# EAGLE design brunnen_v2 (EAGLE 9.5.2)
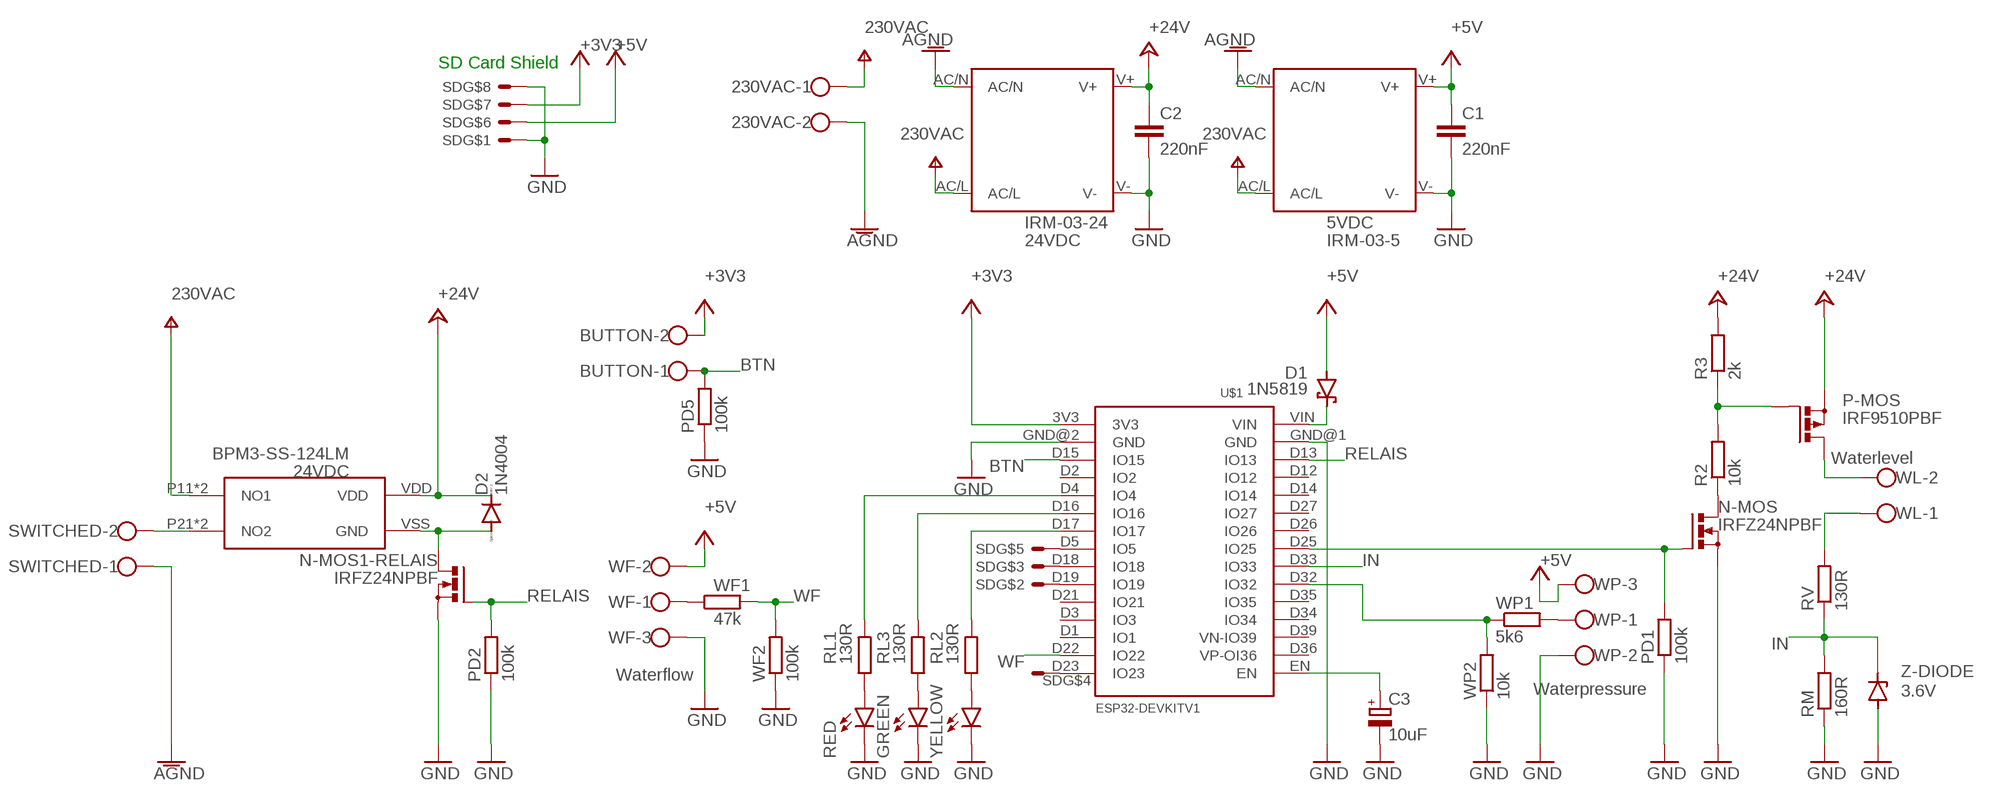
[diagram p0: schematic, sheet 1]

## Parts
230VAC  W237-102  [W237-102]
BUTTON  W237-102  [W237-102]
C1  220nF  C-EU025-025X050  [C025-025X050]
C2  220nF  C-EU025-025X050  [C025-025X050]
C3  10uF  CPOL-EUE2-4  [E2-4]
D1  1N5819  1N5819-B  [DO41-7.6]
D2  1N4004  [DO41-10]
GREEN  LED5MM  [LED5MM]
IRM-03-5  5VDC  IRM_03IRM_03  [IRM_03]
IRM-03-24  24VDC  IRM_03IRM_03  [IRM_03]
N-MOS  IRFZ24NPBF  PMOSFET_NTO220BV  [TO220BV]
N-MOS1-RELAIS  IRFZ24NPBF  PMOSFET_NTO220BV  [TO220BV]
P-MOS  IRF9510PBF  PMOSFET_PTO220BV  [TO220BV]
PD1  100k  R-EU_0207/10  [0207/10]
PD2  100k  R-EU_0207/10  [0207/10]
PD5  100k  R-EU_0207/10  [0207/10]
R2  10k  R-EU_0207/10  [0207/10]
R3  2k  R-EU_0207/10  [0207/10]
RED  LED5MM  [LED5MM]
RL1  130R  R-EU_0207/10  [0207/10]
RL2  130R  R-EU_0207/10  [0207/10]
RL3  130R  R-EU_0207/10  [0207/10]
RM  160R  R-EU_0207/10  [0207/10]
RV  130R  R-EU_0207/10  [0207/10]
SD  322-16-DUAL  [322-16-DUAL]
SWITCHED  W237-102  [W237-102]
U$1  ESP32DEVKITV1  [ESP32-DEVKITV1]
U$2  BPM3-SS-124LM  [BPM3-SS-124LM]
WF  Waterflow  W237-103  [W237-103]
WF1  47k  R-EU_0207/10  [0207/10]
WF2  100k  R-EU_0207/10  [0207/10]
WL  Waterlevel  W237-102  [W237-102]
WP  Waterpressure  W237-103  [W237-103]
WP1  5k6  R-EU_0207/10  [0207/10]
WP2  10k  R-EU_0207/10  [0207/10]
YELLOW  LED5MM  [LED5MM]
Z-DIODE  3.6V  ZENER-DIODEF126-10  [F126Z10]

## Nets
+3V3: BUTTON.2 SD.13 SD.14 U$1.3V3
+5V: C1.1 D1.A IRM-03-5.V+ SD.11 SD.12 WF.2 WP.3
+24V: C2.1 D2.C IRM-03-24.V+ P-MOS.S R3.2 U$2.VDD
AGND: 230VAC.2 IRM-03-5.AC/N IRM-03-24.AC/N SWITCHED.1
BTN: BUTTON.1 PD5.2 U$1.D15(IO15)
GND: C1.2 C2.2 C3.- GREEN.K(C) IRM-03-5.V- IRM-03-24.V- N-MOS1-RELAIS.S N-MOS.S PD1.1 PD2.1 PD5.1 RED.K(C) RM.1 SD.1 SD.2 SD.15 SD.16 U$1.GND@1(GND) U$1.GND@2(GND) WF2.1 WF.3 WP2.1 WP.2 YELLOW.K(C) Z-DIODE.A
IN: RM.2 RV.1 U$1.D33(IO33) Z-DIODE.C
N$1: N-MOS.G PD1.2 U$1.D25(IO25)
N$2: N-MOS.D R2.1
N$3: P-MOS.G R2.2 R3.1
N$4: P-MOS.D WL.2
N$5: D1.C U$1.VIN
N$6: SWITCHED.2 U$2.P21(NO2) U$2.P22(NO2)
N$7: WF1.1 WF.1
N$8: D2.A N-MOS1-RELAIS.D U$2.VSS(GND)
N$9: WP1.2 WP.1
N$10: U$1.D32(IO32) WP1.1 WP2.2
N$14: RV.2 WL.1
N$16: RED.A RL1.1
N$17: RL2.2 U$1.D17(IO17)
N$18: RL2.1 YELLOW.A
N$19: GREEN.A RL3.1
N$20: RL3.2 U$1.D16(IO16)
N$21: RL1.2 U$1.D4(IO4)
N$22: SD.7 SD.8 U$1.D23(IO23)
N$23: C3.+ U$1.EN
N$24: SD.5 SD.6 U$1.D18(IO18)
N$25: SD.9 SD.10 U$1.D5(IO5)
N$26: SD.3 SD.4 U$1.D19(IO19)
RELAIS: N-MOS1-RELAIS.G PD2.2 U$1.D13(IO13)
V+: 230VAC.1 IRM-03-5.AC/L IRM-03-24.AC/L U$2.P11(NO1) U$2.P12(NO1) ; supply symbol labelled 230VAC
WF: U$1.D22(IO22) WF1.2 WF2.2
Unconnected: U$1.D1(IO1) U$1.D2(IO2) U$1.D3(IO3) U$1.D12(IO12) U$1.D14(IO14) U$1.D21(IO21) U$1.D26(IO26) U$1.D27(IO27) U$1.D34(IO34) U$1.D35(IO35) U$1.D36(VP-OI36) U$1.D39(VN-IO39)

## Notes on the sheet
- SD Card Shield

## Library data of the parts
230VAC BUTTON SWITCHED WL = con-wago-500:W237-102: WAGO SCREW CLAMP; MPN: 237-102; OC_FARNELL: unknown; OC_NEWARK: 70K9898
C1 C2 = rcl:C-EU: CAPACITOR, European symbol; SPICEPREFIX: C
C3 = rcl:CPOL-EU: POLARIZED CAPACITOR, European symbol; SPICEPREFIX: C
D1 = diode:1N581*: 1.0A SCHOTTKY BARRIER RECTIFIER Source: http://www.diodes.com/datasheets/ds23001.pdf
D2 = diode:1N4004: DIODE general purpose rectifier, 1 A
GREEN RED YELLOW = led:LED: LED OSRAM: - CHIPLED LG R971, LG N971, LY N971, LG Q971, LY Q971, LO R971, LY R971 LH N974, LH R974 LS Q976, LO Q976, LY Q976 LO Q996 - Hyper CHIPLED LW Q18S LB Q993, LB Q99A, LB R99A - SideLED LS A670, LO A670, LY A670, LG A670, LP A670 LB A673, LV A673, LT A673, LW A673 LH A674 LY A675 LS A676, LA A676, LO A676, LY A676, LW A676 LS A679, LY A679, LG A679 - Hyper Micro SIDELED® LS Y876, LA Y876, LO Y876, LY Y876 LT Y87S - SmartLED LW L88C, LW L88S LB L89C, LB L89S, LG L890 LS L89K, LO L89K, LY L89K LS L896, LA L896, LO L896, LY L896 - TOPLED LS T670, LO T670, LY T670, LG T670, LP T670 LSG T670, LSP T670, LSY T670, LOP T670, LYG T670 LG T671, LOG T671, LSG T671 LB T673, LV T673, LT T673, LW T673 LH T674 LS T676, LA T676, LO T676, LY T676, LB T676, LH T676, LSB T676, LW T676 LB T67C, LV T67C, LT T67C, LS T67K, LO T67K, LY T67K, LW E67C LS E67B, LA E67B, LO E67B, LY E67B, LB E67C, LV E67C, LT E67C LW T67C LS T679, LY T679, LG T679 LS T770, LO T770, LY T770, LG T770, LP T770 LB T773, LV T773, LT T773, LW T773 LH T774 LS E675, LA E675, LY E675, LS T675 LS T776, LA T776, LO T776, LY T776, LB T776 LHGB T686 LT T68C, LB T68C - Hyper Mini TOPLED® LB M676 - Mini TOPLED Santana® LG M470 LS M47K, LO M47K, LY M47K Source: http://www.osram.convergy.de LUXEON: - LUMILED® LXK2-PW12-R00, LXK2-PW12-S00, LXK2-PW14-U00, LXK2-PW14-V00 LXK2-PM12-R00, LXK2-PM12-S00, LXK2-PM14-U00 LXK2-PE12-Q00, LXK2-PE12-R00, LXK2-PE12-S00, LXK2-PE14-T00, LXK2-PE14-U00 LXK2-PB12-K00, LXK2-PB12-L00, LXK2-PB12-M00, LXK2-PB14-N00, LXK2-PB14-P00, LXK2-PB14-Q00 LXK2-PR12-L00, LXK2-PR12-M00, LXK2-PR14-Q00, LXK2-PR14-R00 LXK2-PD12-Q00, LXK2-PD12-R00, LXK2-PD12-S00 LXK2-PH12-R00, LXK2-PH12-S00 LXK2-PL12-P00, LXK2-PL12-Q00, LXK2-PL12-R00 Source: www.luxeon.com KINGBRIGHT: KA-3528ASYC Source: www.kingbright.com
IRM-03-5 IRM-03-24 = meanwell_irm_v7:IRM_03: 3 watt IRM 03 Vout [V] Imax [A] Pmax [W] Eff [%] 3.3 0.9 3 68 5 0.6 3 72 9 0.33 3 77 12 0.25 3 78 15 0.2 3 78 24 0.125 3 80
N-MOS N-MOS1-RELAIS = transistor-power:PMOSFET_N: Power MOSFET N-Channel
P-MOS = transistor-power:PMOSFET_P: Power MOSFET P-Channel
PD1 PD2 PD5 R2 R3 RL1-RL3 RM RV WF1 WF2 WP1 WP2 = rcl:R-EU_: RESISTOR, European symbol; SPICEPREFIX: R
SD = con-garry:322-16-DUAL
U$1 = ESP32-DEVKITV1:ESP32DEVKITV1
U$2 = Costum Relais:BPM3-SS-124LM
WF WP = con-wago-500:W237-103: WAGO SCREW CLAMP; MPN: 237-103; OC_FARNELL: unknown; OC_NEWARK: 18M7116
Z-DIODE = diode:ZENER-DIODE: Z-Diode

## Board
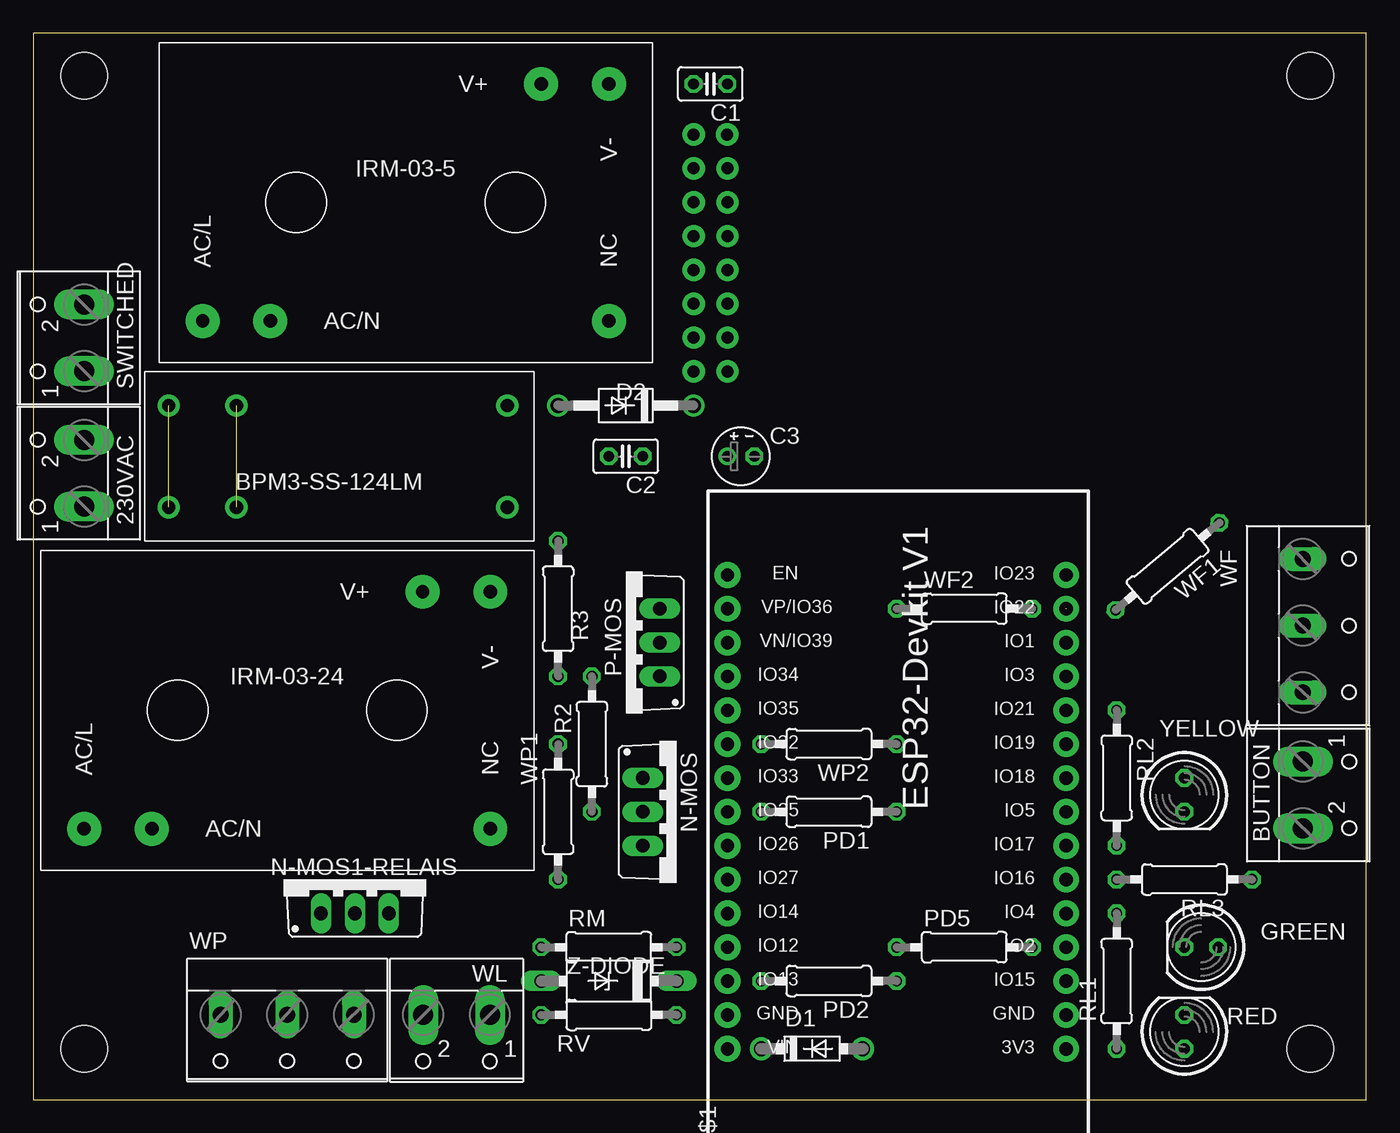
[diagram p1: board, top side]
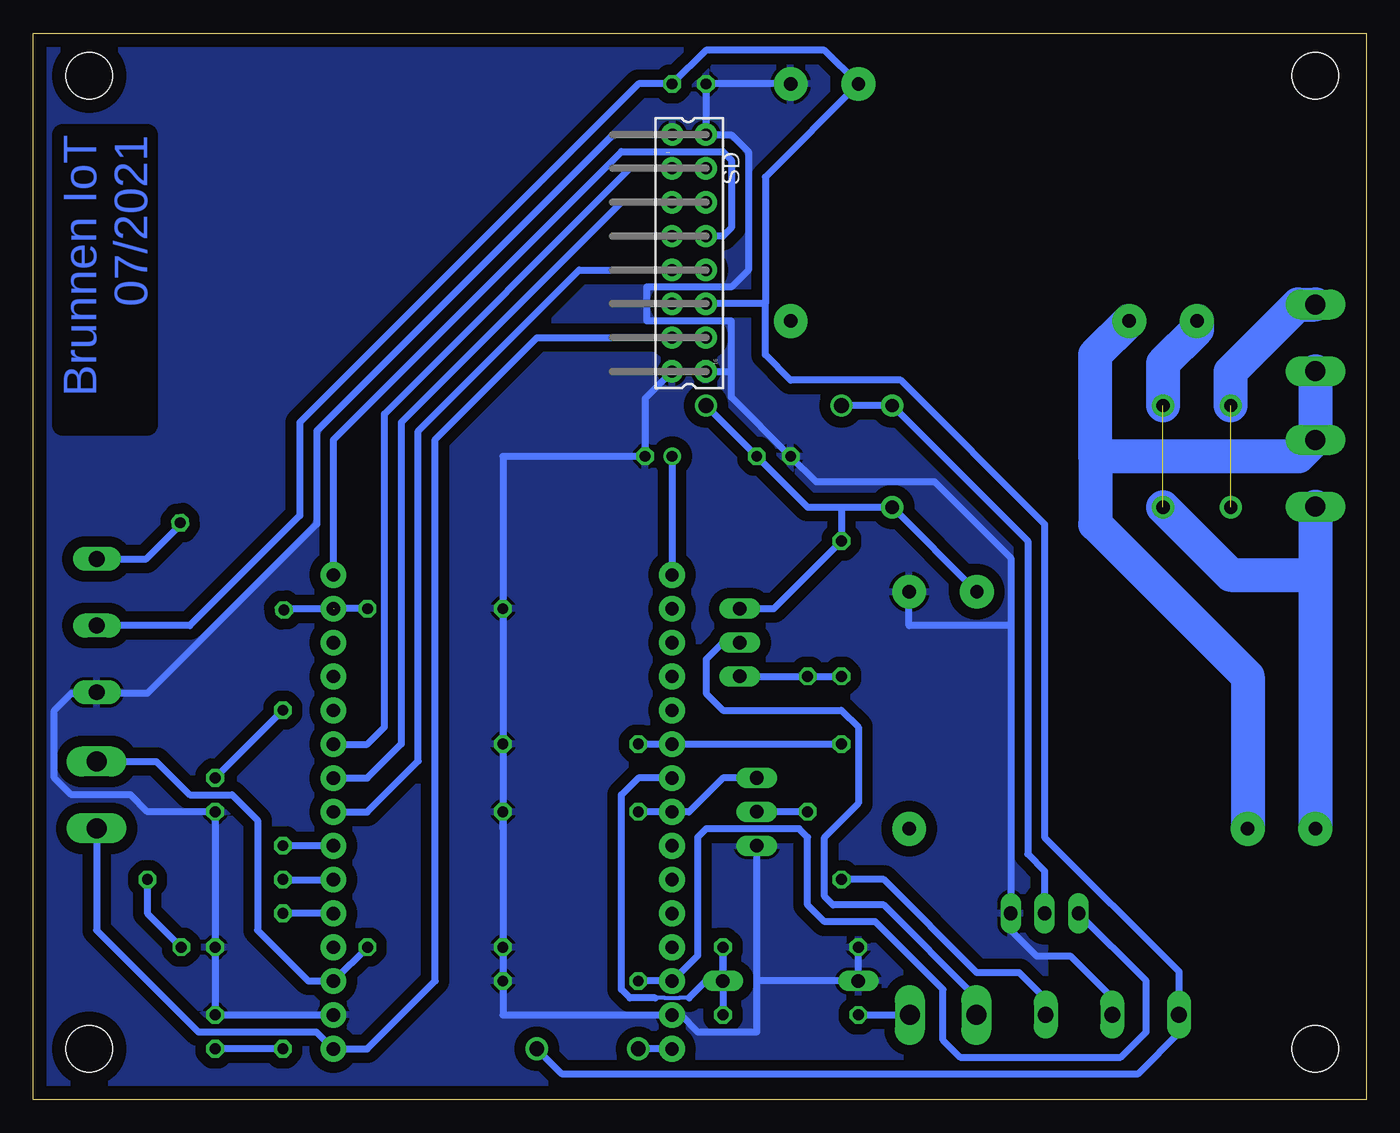
[diagram p2: board, bottom side, seen from below]

Size 100 x 80 mm. Coordinates in mm from the lower left corner, seen from the top.
Outline: 0,0 100,0 100,80 0,80 0,0
Copper layers (1*16): Top 0.035mm / dielectric 1.5mm / Bottom 0.035mm
Design rules "default": minimum track width 6mil, minimum drill 0.35mm, track to track 6mil, track to pad 6mil, pad to pad 6mil, via to via 6mil, smd to smd 6mil, copper to edge 40mil, drill to drill 6mil, minimum pad ring 10mil, minimum via ring 8mil, stop-mask expansion 4mil, vias tented up to drill 0mil, thermal gap 10mil
Holes 3.5 mm at 3.81,76.81 95.81,76.81 95.81,3.81 3.81,3.81

### Footprints (pad centres in the part's own frame; a part is rotated, then mirrored left to right if it is on the bottom)
W237-102 = drill 1.5 long: 1 -2.5,-1.27; 2 2.5,-1.27
C025-025X050 = drill 0.813 octagon: 1 -1.27,0; 2 1.27,0
E2-4 = drill 0.813 pad 1.27: + -1.016,0 | drill 0.813 pad 1.27 octagon: - 1.016,0
DO41-7.6 = drill 1.1 pad 1.7: A 3.81,0; C -3.81,0
DO41-10 = drill 1.118: A 5.08,0; C -5.08,0
LED5MM = drill 0.813 octagon: A -1.27,0; K 1.27,0
IRM_03 = drill 1 pad 2.54: AC/L -15.24,-8.89; AC/N -10.16,-8.89; NC 15.24,-8.89; V+ 10.16,8.89; V- 15.24,8.89
TO220BV = drill 1.016 long: D 0,-2.54; G -2.54,-2.54; S 2.54,-2.54
0207/10 = drill 0.813 octagon: 1 -5.08,0; 2 5.08,0
322-16-DUAL = drill 0.9 pad 1.676: 1 -8.905,-1.254; 2 -8.905,1.254; 3 -6.365,-1.286; 4 -6.365,1.254; 5 -3.825,-1.286; 6 -3.825,1.254; 7 -1.285,-1.286; 8 -1.285,1.254; 9 1.255,-1.286; 10 1.255,1.254; 11 3.795,-1.286; 12 3.795,1.254; 13 6.335,-1.286; 14 6.335,1.254; 15 8.875,-1.286; 16 8.875,1.254
ESP32-DEVKITV1 = drill 1 pad 1.93: 3V3 -16.52,-12.27; D1 13.96,-12.27; D2 -8.9,-12.27; D3 11.42,-12.27; D4 -6.36,-12.27; D5 1.26,-12.27; D12 -8.9,13.135; D13 -11.44,13.135; D14 -6.36,13.135; D15 -11.44,-12.27; D16 -3.82,-12.27; D17 -1.28,-12.27; D18 3.8,-12.27; D19 6.34,-12.27; D21 8.88,-12.27; D22 16.5,-12.27; D23 19.04,-12.27; D25 1.26,13.135; D26 -1.28,13.135; D27 -3.82,13.135; D32 6.34,13.135; D33 3.8,13.135; D34 11.42,13.135; D35 8.88,13.135; D36 16.5,13.135; D39 13.96,13.135; EN 19.04,13.135; GND@1 -13.98,13.135; GND@2 -13.98,-12.27; VIN -16.52,13.135
BPM3-SS-124LM = drill 1 pad 1.676: P11 8.89,3.81; P12 8.89,-3.81; P21 13.97,3.81; P22 13.97,-3.81; VDD -11.43,3.81; VSS -11.43,-3.81
W237-103 = drill 1.194 long: 1 -5,-1.29; 2 0,-1.29; 3 5,-1.29
F126Z10 = drill 1.016 long: A 5.08,0; C -5.08,0

### Placement (x,y rotation side)
230VAC  2.54,46.99 90 top
BUTTON  96.52,22.86 270 top
C1  50.8,76.2 180 top
C2  44.45,48.26 180 top
C3  53.09,48.26 0 top
D1  58.42,3.81 0 top
D2  44.45,52.07 180 top
GREEN  87.63,11.43 180 top
IRM-03-5  27.94,67.31 0 top
IRM-03-24  19.05,29.21 0 top
N-MOS  48.26,21.59 270 top
N-MOS1-RELAIS  24.13,16.51 0 top
P-MOS  44.45,34.29 90 top
PD1  59.69,21.59 180 top
PD2  59.69,8.89 180 top
PD5  69.85,11.43 0 top
R2  41.91,26.67 90 top
R3  39.37,36.83 90 top
RED  86.36,5.08 90 top
RL1  81.28,8.89 90 top
RL2  81.28,24.13 270 top
RL3  86.36,16.51 180 top
RM  43.18,11.43 0 top
RV  43.18,6.35 180 top
SD  50.8,63.5 270 bottom
SWITCHED  2.54,57.15 90 top
U$1  65.21,20.32 90 top
U$2  24.13,48.26 180 top
WF  96.52,35.56 270 top
WF1  85.09,40.01 220 top
WF2  69.85,36.83 0 top
WL  31.75,5.08 180 top
WP  19.05,5.08 180 top
WP1  39.37,21.59 270 top
WP2  59.69,26.67 180 top
YELLOW  86.36,22.86 270 top
Z-DIODE  43.18,8.89 180 top

### Tracks (layer width: path | path; a pad name or v marks a point on that pad's centre or on a via)
+3V3
  Bottom 0.508: SD.14 SD.13 62.22,57.16 69.85,49.53 69.85,8.89 74.94,3.8 U$1.3V3 78.76,5.08 87.63,5.08 95.25,12.7 BUTTON.2
+5V
  Bottom 0.508: 45.09,59.7 SD.12 SD.11 | D1.A 60.33,1.91 17.14,1.91 13.97,5.08 13.97,6.29 WP.3 14.05,9.61 24.13,19.68 24.13,43.18 34.92,53.98 43.18,53.98 45.09,55.88 45.09,59.7 | WF.2 88.27,35.56 80.01,43.81 80.01,50.8 54.61,76.2 C1.1 49.54,78.73 40.63,78.73 IRM-03-5.V+ 45.09,69.22 45.09,59.7
+24V
  Bottom 0.508: D2.C C2.1 41.91,44.45 39.37,44.45 | 39.37,44.45 R3.2 44.45,36.83 P-MOS.S | IRM-03-24.V+ U$2.VDD 39.37,44.45
AGND
  Bottom 2.54: SWITCHED.1 230VAC.2 3.85,49.49 5.08,48.26 20.32,48.26 | IRM-03-5.AC/N 20.32,55.88 20.32,48.26 | IRM-03-24.AC/N 8.89,31.75 20.32,43.18 20.32,48.26
BTN
  Bottom 0.508: BUTTON.1 90.77,25.36 88.27,22.86 85.09,22.86 83.19,20.95 83.19,12.7 79.38,8.89 U$1.D15 | PD5.2 77.47,8.89 U$1.D15 | U$1.D15
GND
  Bottom 0.508: IRM-03-5.V- C1.2 49.55,76.18 SD.2 | SD.2 SD.1 56.5,72.41 78.74,50.16 78.74,43.18 91.44,30.48 95.15,30.48 | 64.77,20.32 PD1.1 | PD1.1 PD5.1 PD2.1 64.77,6.35 U$1.GND@1 | U$1.GND@2 RED.K GREEN.K YELLOW.K 91.44,21.59 92.71,22.86 97.16,22.86 98.42,24.13 98.42,29.21 97.16,30.48 95.15,30.48 | SD.16 SD.15 54.1,52.61 C3.- 64.77,48.26 WF2.1 WP2.1 PD1.1 | SD.16 | U$1.GND@1 | 45.72,8.89 N-MOS.S | RM.1 Z-DIODE.A 45.72,8.89 | 45.72,8.89 45.72,5.08 50.16,5.08 51.42,6.34 U$1.GND@1 | WP.2 19.05,7.62 22.2,10.77 24.74,10.77 26.67,12.7 N-MOS1-RELAIS.S 26.67,35.56 | 26.67,35.56 26.67,40.64 32.38,46.35 41.27,46.35 C2.2 47.62,52.7 47.62,54.61 | 26.67,35.56 34.29,35.56 IRM-03-24.V- | SD.16 49.53,54.61 47.62,54.61 | 47.62,54.61 47.62,58.42 53.98,58.42 53.98,60.96 47.62,60.96 46.35,62.23 46.35,71.12 47.62,72.39 49.53,72.39 SD.2 | 95.15,30.48 WF.3
  pour Bottom (isolate 0.813, rank 2): 24.13,80.01 24.13,0 100.33,0 100.33,80.01
IN
  Bottom 0.305: 50.8,7.62 51.54,7.62 51.55,7.61 52.61,7.61 52.62,7.62 53.34,7.62
  Bottom 0.508: RV.1 RM.2 Z-DIODE.C 49.53,8.89 50.8,7.62 | U$1.D33 54.61,24.13 55.88,22.86 55.88,8.26 55.24,7.62 53.34,7.62
N$1
  Bottom 0.508: N-MOS.G 48.26,24.13 50.81,21.58 U$1.D25 PD1.2
N$2
  Bottom 0.508: R2.1 N-MOS.D
N$3
  Bottom 0.508: P-MOS.G R2.2 R3.1
N$4
  Bottom 0.508: P-MOS.D 48.26,34.29 49.53,33.02 49.53,30.48 48.26,29.21 39.37,29.21 38.1,27.94 38.1,22.23 40.64,19.68 40.64,15.24 40.01,14.61 36.2,14.61 29.23,7.64 29.25,7.62 WL.2
N$5
  Bottom 0.508: U$1.VIN D1.C
N$6  (1 unrouted)
  Bottom 2.54: SWITCHED.2 5.12,59.65 10.16,54.61 U$2.P22
N$7
  Bottom 0.508: WF.1 91.52,40.56 88.98,43.1 WF1.1
N$8
  Bottom 0.508: D2.A U$2.VSS 25.4,41.91 25.4,18.41 24.13,17.14 N-MOS1-RELAIS.D
N$9
  Bottom 0.508: WP1.2 36.2,16.51 29.21,9.53 26.04,9.53 24.13,7.62 24.13,6.45 WP.1
N$10
  Bottom 0.508: 54.61,26.65 WP2.2 U$1.D32 | U$1.D32 WP1.1 | U$1.D32
N$14
  Bottom 0.508: 34.29,6.35 WL.1 RV.2
N$16
  Bottom 0.508: RL1.1 RED.A
N$17
  Bottom 0.508: U$1.D17 77.5,19.05 RL2.2
N$18
  Bottom 0.508: RL2.1 YELLOW.A
N$19
  Bottom 0.508: RL3.1 91.44,13.97 GREEN.A
N$20
  Bottom 0.508: RL3.2 U$1.D16
N$21
  Bottom 0.508: U$1.D4 77.5,13.97 RL1.2
N$22
  Bottom 0.508: SD.7 SD.8 49.53,64.77 48.26,64.77 47.62,65.41 47.62,70.48 48.26,71.12 55.88,71.12 77.48,49.52 U$1.D23
N$23
  Bottom 0.508: C3.+ U$1.EN
N$24
  Bottom 0.508: U$1.D18 74.94,24.12 72.39,26.67 72.39,50.8 55.87,67.33 SD.5 SD.6
N$25
  Bottom 0.508: U$1.D5 74.94,21.58 71.12,25.4 71.12,50.16 59.04,62.24 SD.9 SD.10
N$26
  Bottom 0.508: U$1.D19 74.94,26.66 73.66,27.94 73.66,51.44 55.23,69.86 SD.3 SD.4
RELAIS
  Bottom 0.508: U$1.D13 | U$1.D13 50.8,10.16 50.16,10.79 50.16,19.68 49.53,20.32 42.55,20.32 41.91,19.68 41.91,14.61 40.64,13.34 36.83,13.34 31.75,8.26 31.75,4.45 30.48,3.17 18.41,3.17 16.51,5.08 16.51,8.89 N-MOS1-RELAIS.G | U$1.D13 PD2.2
V+  (1 unrouted)
  Bottom 2.54: IRM-03-5.AC/L 12.7,57.78 15.24,55.24 U$2.P12 | 230VAC.1 3.81,39.37 | 3.81,39.37 IRM-03-24.AC/L | U$2.P11 10.16,39.37 3.81,39.37
WF  (1 unrouted)
  Bottom 0.508: WF2.2 U$1.D22 | WF1.2 81.12,36.82 U$1.D22

### Text on the board
Bottom: Brunnen IoT / 07/2021
tDocu: 230V SW | 230V(N) | 230V(N) | 230V(L) | WF... | WF+ | WF- | BT-1 | BT-2 | WP+ | WP- | WP~ | WL+ | WL-